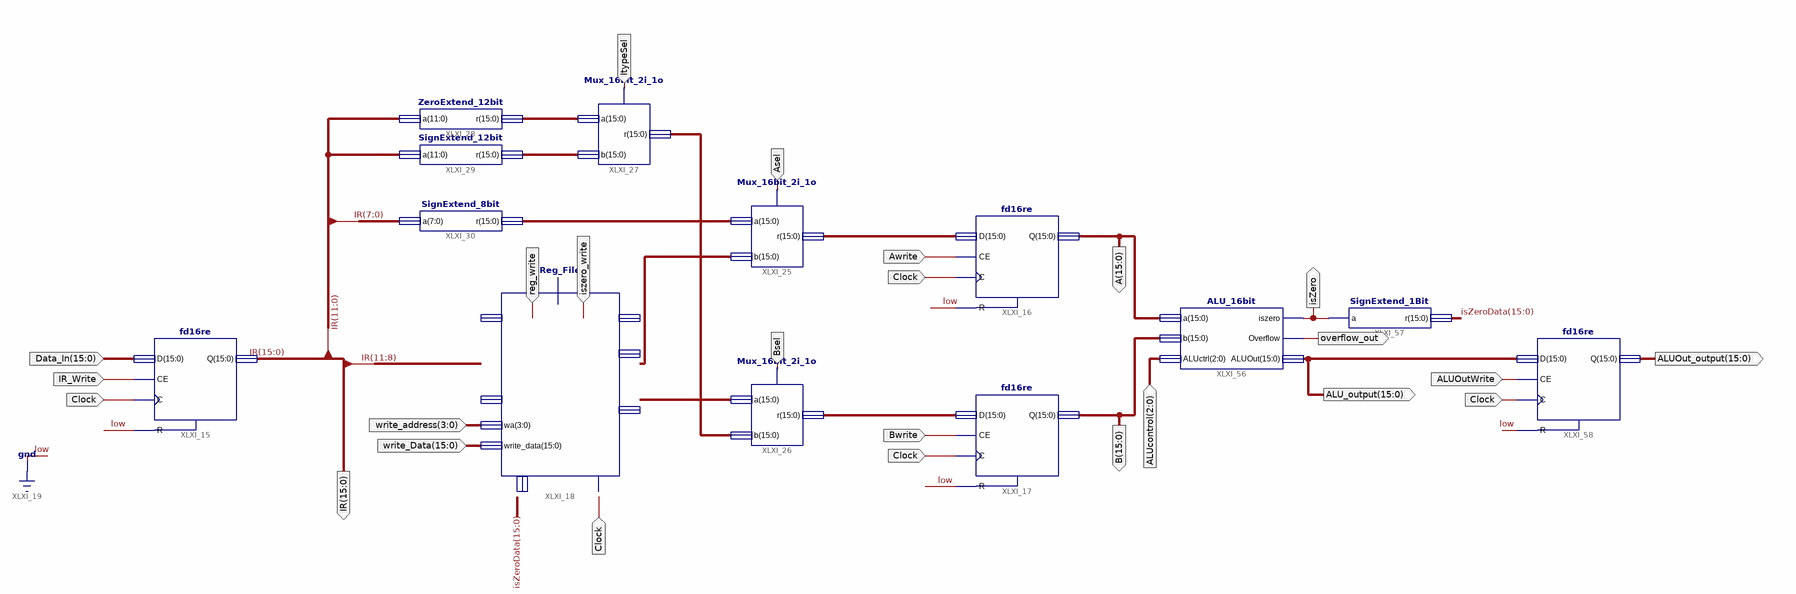
[diagram p0: schematic sheet 1]
// Xilinx ISE schematic Processor_Integration_3.sch (spartan3e) as structural Verilog: 13 symbols, 21 ports
module Processor_Integration_3 (
  input  reg_write,
  input  iszero_write,
  input  [3:0] write_address,
  input  [15:0] Data_In,
  input  IR_Write,
  input  Clock,
  input  ItypeSel,
  input  Bsel,
  input  Asel,
  input  Bwrite,
  input  Awrite,
  input  [2:0] ALUcontrol,
  input  [15:0] write_Data,
  input  ALUOutWrite,
  output [15:0] IR,
  output [15:0] B,
  output [15:0] A,
  output isZero,
  output overflow_out,
  output [15:0] ALU_output,
  output [15:0] ALUOut_output
);

  wire [15:0] isZeroData, XLXN_56, XLXN_57, XLXN_98, XLXN_100, XLXN_101, XLXN_130, XLXN_131, XLXN_144;

  fd16re XLXI_15 (.C(Clock), .CE(IR_Write), .D(Data_In), .R(1'b0), .Q(IR));
  Reg_File XLXI_18 (
    .write_data(write_Data), .reg_write(reg_write), .iszero_write(iszero_write), .acc_data(XLXN_100),
    .ra(IR[11:8]), .read_data(XLXN_98), .wa(write_address), .iszero_data(isZeroData), .clock(Clock));  // open: in_data_write, out_data, in_data
  SignExtend_12bit XLXI_29 (.a(IR[11:0]), .r(XLXN_57));
  ZeroExtend_12bit XLXI_28 (.a(IR[11:0]), .r(XLXN_56));
  SignExtend_8bit XLXI_30 (.a(IR[7:0]), .r(XLXN_101));
  Mux_16bit_2i_1o XLXI_27 (.b(XLXN_57), .r(XLXN_144), .s(ItypeSel), .a(XLXN_56));
  Mux_16bit_2i_1o XLXI_26 (.b(XLXN_144), .r(XLXN_131), .s(Bsel), .a(XLXN_98));
  Mux_16bit_2i_1o XLXI_25 (.b(XLXN_100), .r(XLXN_130), .s(Asel), .a(XLXN_101));
  fd16re XLXI_17 (.C(Clock), .CE(Bwrite), .D(XLXN_131), .R(1'b0), .Q(B));
  fd16re XLXI_16 (.C(Clock), .CE(Awrite), .D(XLXN_130), .R(1'b0), .Q(A));
  ALU_16bit XLXI_56 (.a(A), .b(B), .ALUctrl(ALUcontrol), .iszero(isZero), .Overflow(overflow_out), .ALUOut(ALU_output));
  SignExtend_1Bit XLXI_57 (.a(isZero), .r(isZeroData));
  fd16re XLXI_58 (.C(Clock), .CE(ALUOutWrite), .D(ALU_output), .R(1'b0), .Q(ALUOut_output));
endmodule
